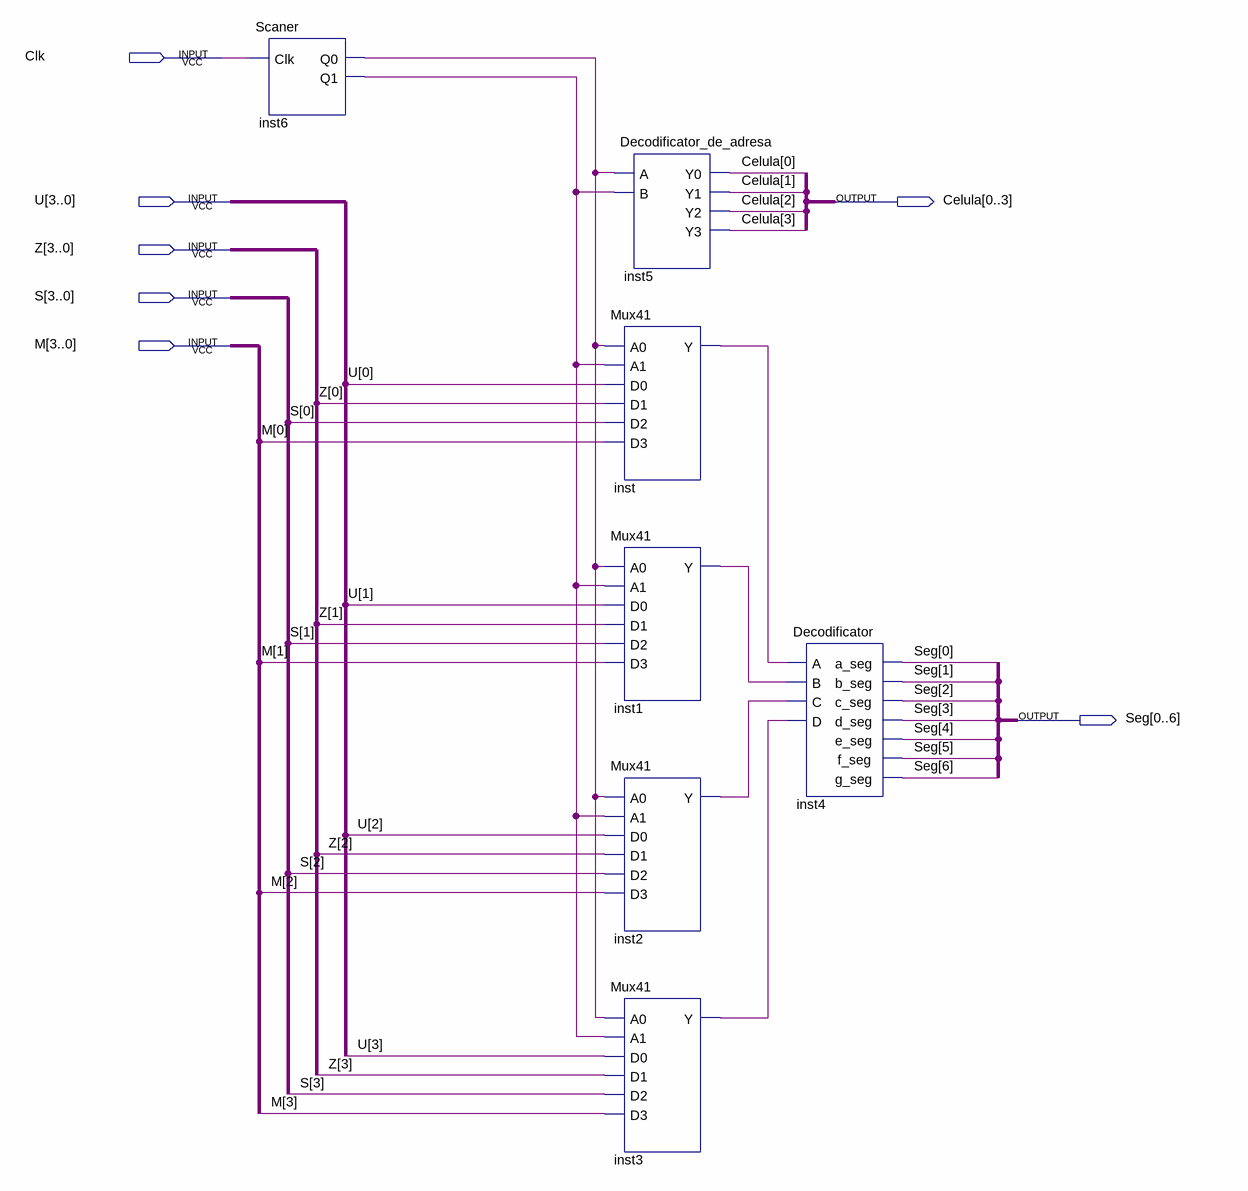
[diagram p0: schematic sheet]
// Quartus schematic Bloc_Decodificare_Afisare.bdf as structural Verilog: 7 symbols, 7 pins
module Bloc_Decodificare_Afisare (
  input  Clk,
  input  [3:0] U,
  input  [3:0] Z,
  input  [3:0] S,
  input  [3:0] M,
  output [0:3] Celula,
  output [0:6] Seg
);

  wire inst1_y, inst2_y, inst3_y, inst6_q0, inst6_q1, inst_y;

  Scaner inst6 (.Clk(Clk), .Q0(inst6_q0), .Q1(inst6_q1));
  Mux41 inst (.A0(inst6_q0), .A1(inst6_q1), .D0(U[0]), .D1(Z[0]), .D2(S[0]), .D3(M[0]), .Y(inst_y));
  Mux41 inst1 (.A0(inst6_q0), .A1(inst6_q1), .D0(U[1]), .D1(Z[1]), .D2(S[1]), .D3(M[1]), .Y(inst1_y));
  Mux41 inst2 (.A0(inst6_q0), .A1(inst6_q1), .D0(U[2]), .D1(Z[2]), .D2(S[2]), .D3(M[2]), .Y(inst2_y));
  Mux41 inst3 (.A0(inst6_q0), .A1(inst6_q1), .D0(U[3]), .D1(Z[3]), .D2(S[3]), .D3(M[3]), .Y(inst3_y));
  Decodificator_de_adresa inst5 (
    .A(inst6_q0), .B(inst6_q1), .Y0(Celula[0]), .Y1(Celula[1]), .Y2(Celula[2]), .Y3(Celula[3]));
  Decodificator inst4 (
    .A(inst_y), .B(inst1_y), .C(inst2_y), .D(inst3_y), .a_seg(Seg[0]), .b_seg(Seg[1]), .c_seg(Seg[2]),
    .d_seg(Seg[3]), .e_seg(Seg[4]), .f_seg(Seg[5]), .g_seg(Seg[6]));
endmodule
